# Altium schematic sheet CDR - dont change anything.SchDoc
size A2; SheetNumber: 1; SheetTotal: 4
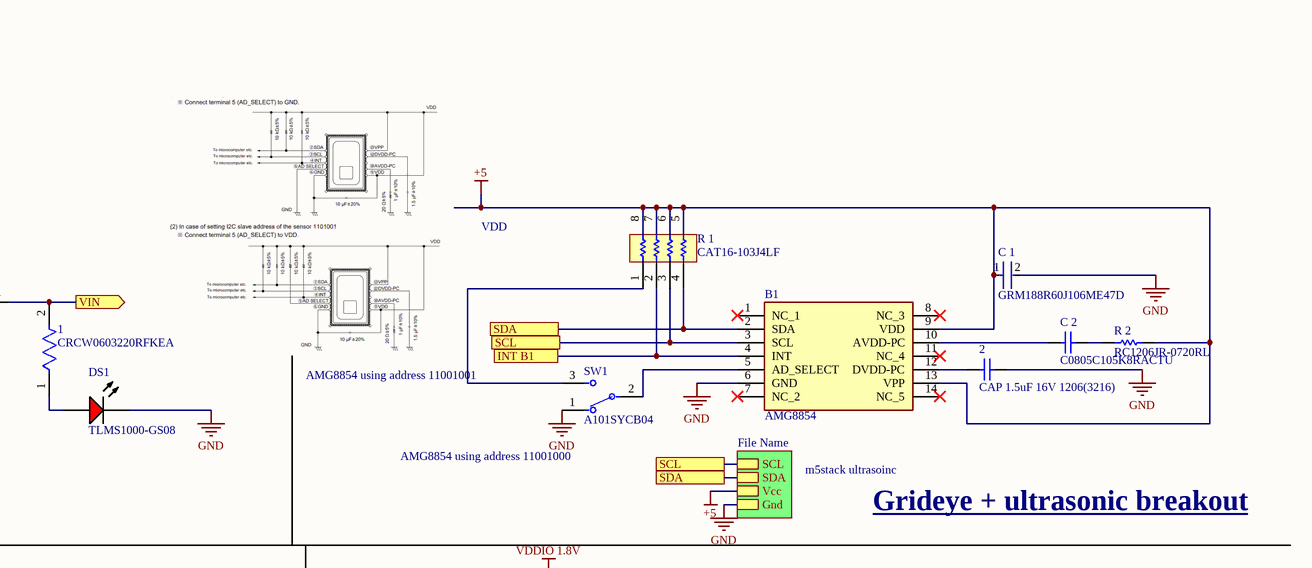
[diagram p0: CDR - dont change anything.SchDoc, top right]
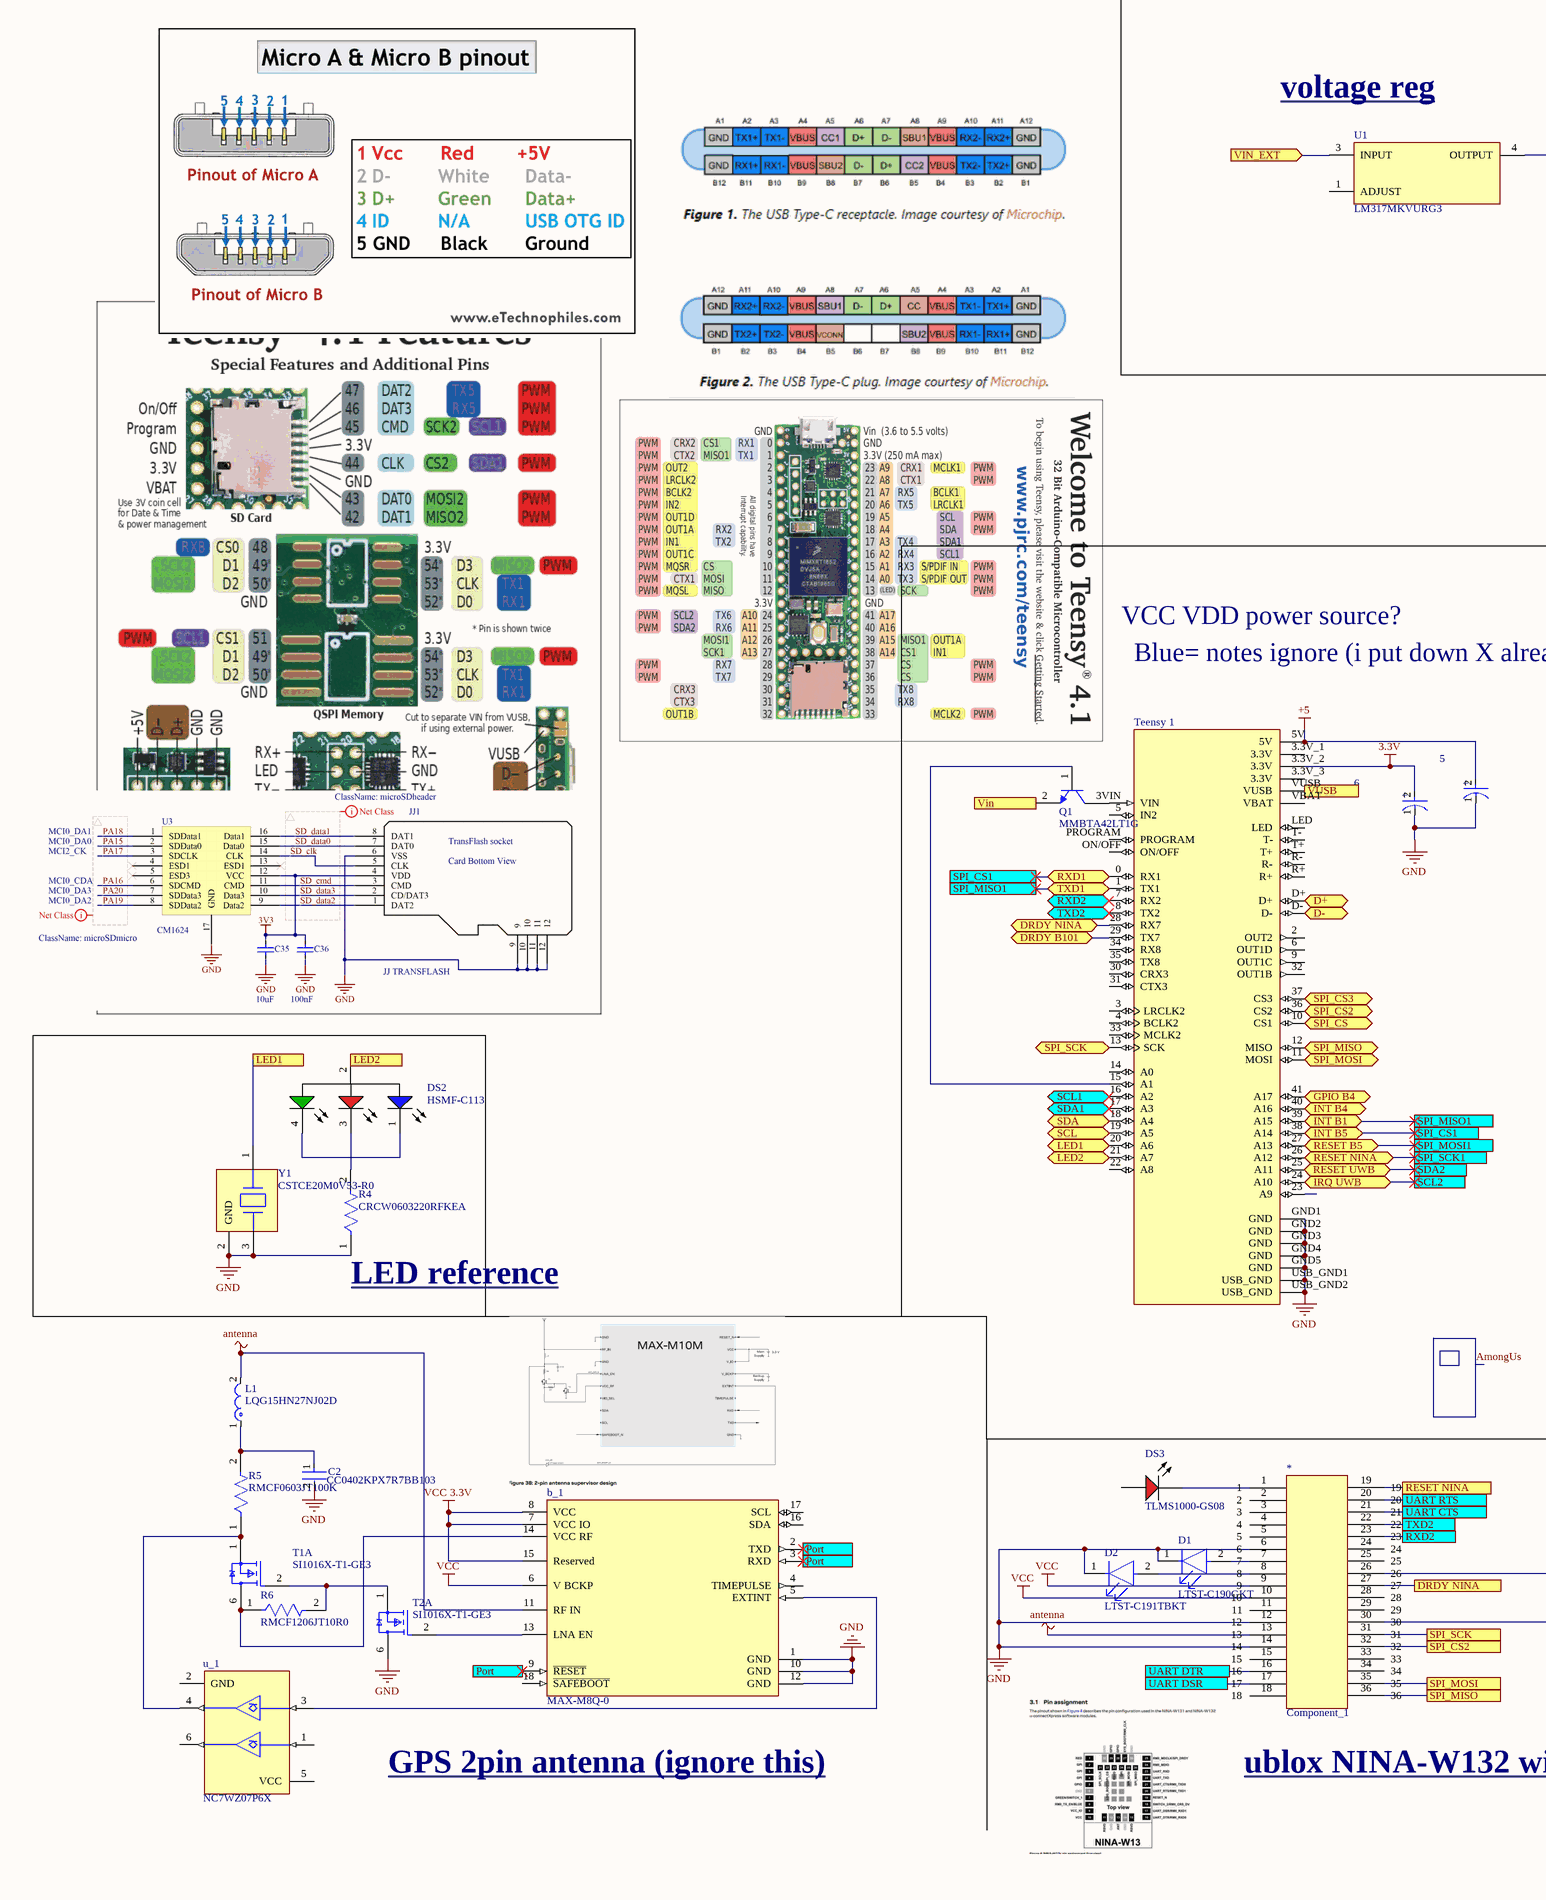
[diagram p1: CDR - dont change anything.SchDoc, bottom left]
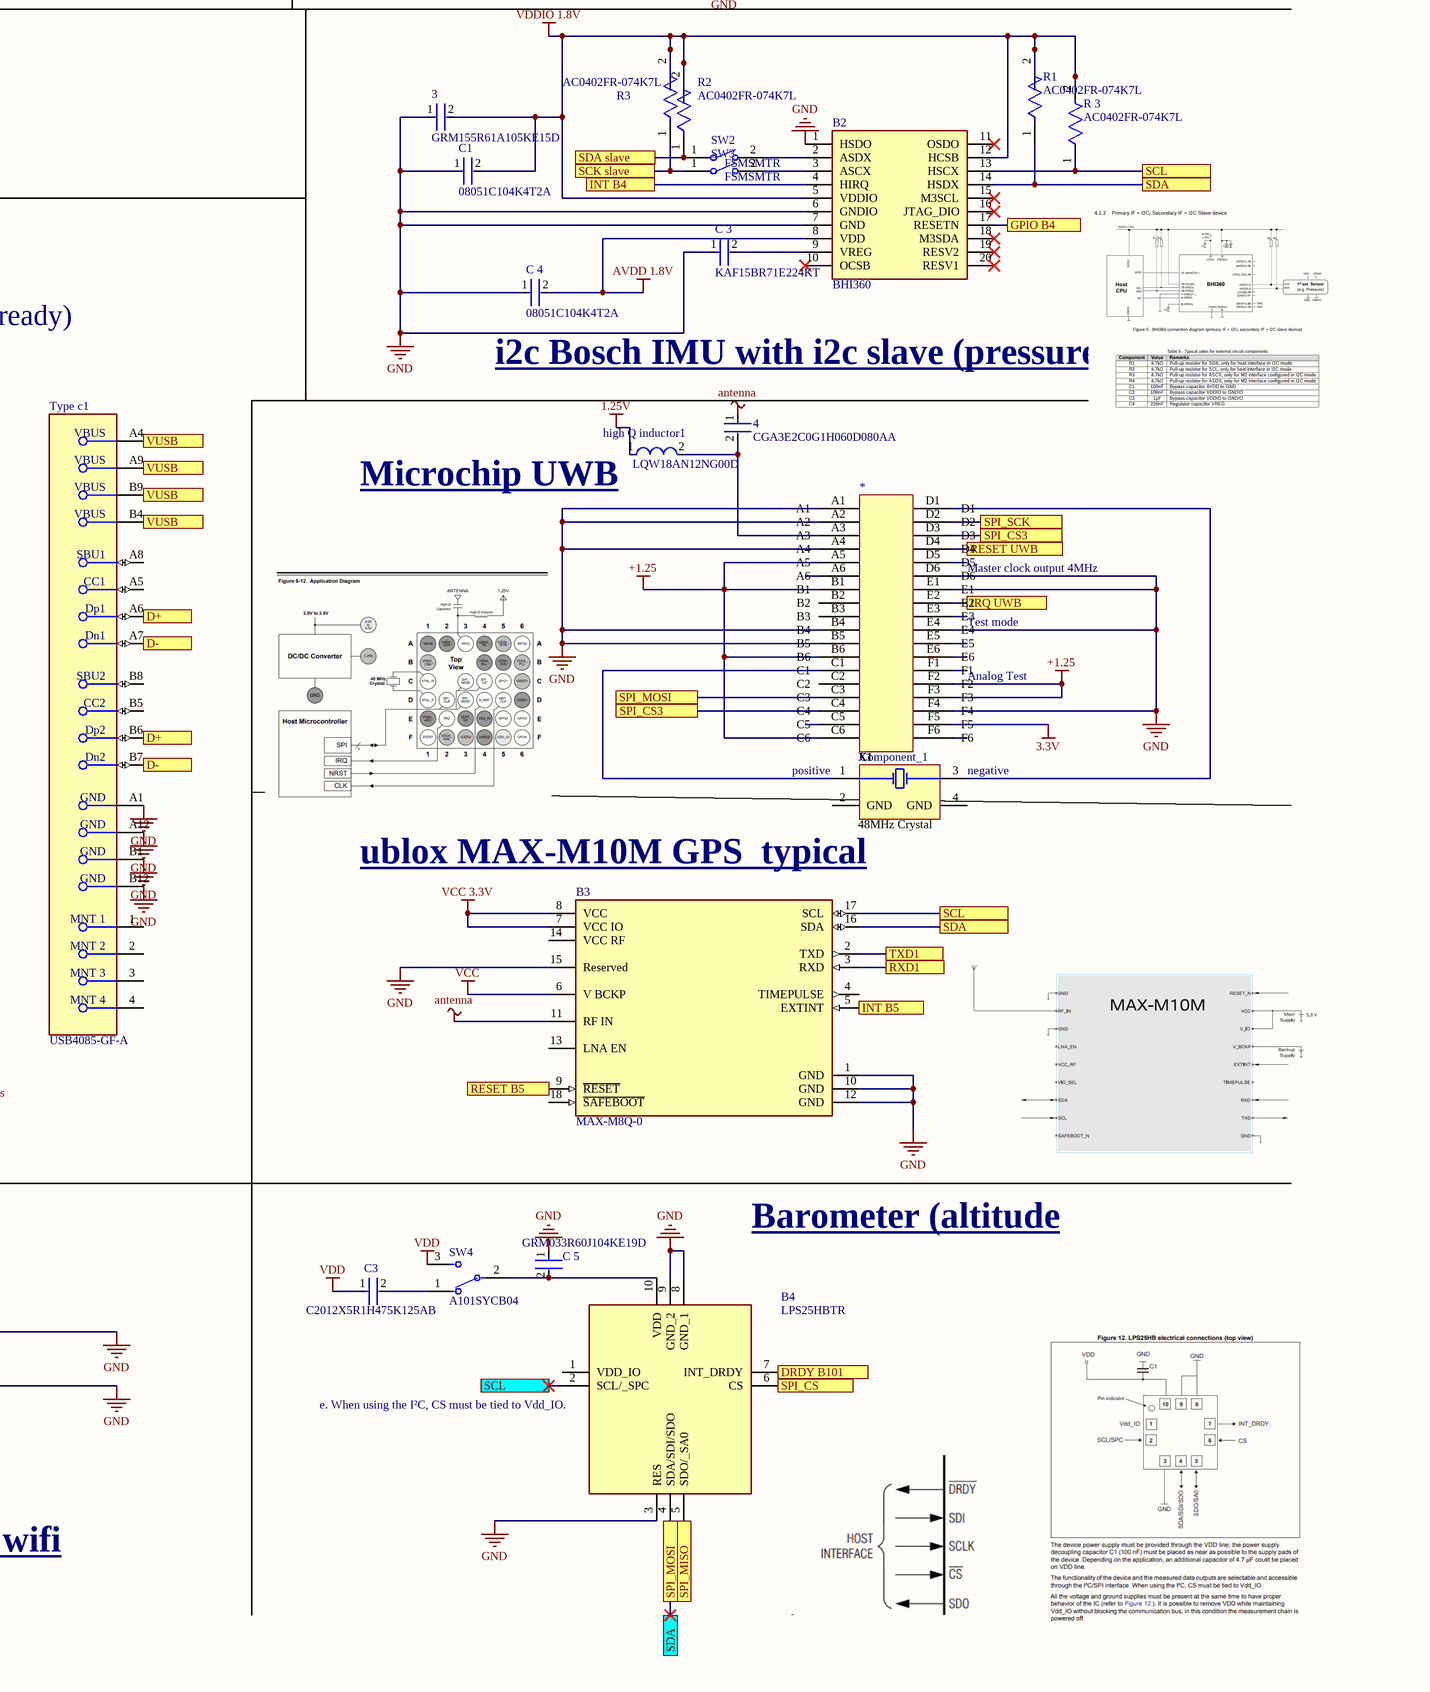
[diagram p2: CDR - dont change anything.SchDoc, bottom right]

## Parts
(Parts that share a designator on the sheet are numbered #1, #2 ... from top to bottom, then left to right.)
1  CRCW0603220RFKEA  [FP-CRCW0603-e3-MFG]
2  CAP 1.5uF 16V 1206(3216)  [CAPC1206(3216)190_M]
3  GRM155R61A105KE15D  [FP-GRM15-0_1-MFG]
4  CGA3E2C0G1H060D080AA  [FP-CGA3E-0_3-0_1-MFG]
5  293D105X0016A2TE3  [FP-293DA-MFG]  (value not drawn)
6  293D105X0016A2TE3  [FP-293DA-MFG]  (value not drawn)
*#1  Component_1  [ATA8350 - duplicate]
*#2  Component_1  [NINA-W131]
B1  AMG8854  [AMG8854]
B2  BHI360  [BHI360]
B3  MAX-M8Q-0  [FP-MAX-M8Q-0-MFG]
B4  LPS25HBTR  [LPS25HBTR]
b_1  MAX-M8Q-0  [FP-MAX-M8Q-0-MFG]
C1  08051C104K4T2A  [FP-0805-L_2_01_0_2-W_1_25-IPC_B]
C2  CC0402KPX7R7BB103  [FP-CC0402-MFG]
C3  C2012X5R1H475K125AB  [FP-C2012-125-0_2-IPC_B]
C_1  GRM188R60J106ME47D  [FP-GRM188-0_1-e0_2_0_55-IPC_A]
C_2  C0805C105K8RACTU  [CAPC2013X100X50ML20T25]
C_3  KAF15BR71E224KT  [FP-KAF15B-MFG]
C_4  08051C104K4T2A  [FP-0805-L_2_01_0_2-W_1_25-IPC_B]
C_5  GRM033R60J104KE19D  [FP-GRM033-0_03-MFG]
D1  LTST-C190GKT  [FP-LTST-C190GKT-MFG]
D2  LTST-C191TBKT  [FP-LTST-C191TBKT-MFG]
DS1  TLMS1000-GS08  [VISH-TLMS1000_V]
DS2  HSMF-C113  [AVAG-HSMF-C11X_H1_V]
DS3  TLMS1000-GS08  [VISH-TLMS1000_V]
high_Q_inductor1  LQW18AN12NG00D  [FP-LQW18AN_00-MFG]
L1  LQG15HN27NJ02D  [FP-LQG15HH_02-MFG]
Q1  MMBTA42LT1G  [ONSC-SOT-23-3-318-08_V]
R1  AC0402FR-074K7L  [FP-AC0402-MFG]
R2  AC0402FR-074K7L  [FP-AC0402-MFG]
R3  AC0402FR-074K7L  [FP-AC0402-MFG]
R4  CRCW0603220RFKEA  [FP-CRCW0603-e3-MFG]
R5  RMCF0603JT100K  [FP-RMCF0603-IPC_C]
R6  RMCF1206JT10R0  [FP-RMCF1206-IPC_C]
R_1  CAT16-103J4LF  [BOUR-CAT16-103J4LF_L]
R_2  RC1206JR-0720RL  [RESC3116X65X40NL10T20]
R_3  AC0402FR-074K7L  [FP-AC0402-MFG]
SW1  A101SYCB04  [FP-A101SYCB04-MFG]
SW2  FSMSMTR  [TECO-FSMSMTR_V]
SW3  FSMSMTR  [TECO-FSMSMTR_V]
SW4  A101SYCB04  [FP-A101SYCB04-MFG]
T1  SI1016X-T1-GE3  [FP-C14-0439-MFG]  (part A of 2)
T2  SI1016X-T1-GE3  [FP-C14-0439-MFG]  (part A of 2)
Teensy_1  Teensy 4.1  [MODULE_DEV-16771]  (value not drawn)
Type_c1  USB4085-GF-A  [FP-USB4085-GF-A-MFG]
U1  LM317MKVURG3  [FP-KVU0003A-MFG]
u_1  NC7WZ07P6X  [FP-419AD-01-MFG]
X1  48MHz Crystal  [ABRA-ABM3B-4_V]
Y1  CSTCE20M0V53-R0  [FP-CSTCE_V-MFG]

## Sub-sheets
m5stack ultrasoinc = File Name: SCL, SDA, Vcc, Gnd

## Ports
D+, D+ (bidir), D-, D- (bidir), DRDY B101, DRDY B101 (bidir), DRDY NINA, DRDY NINA (bidir), GPIO B4, GPIO B4 (bidir), INT B1, INT B1 (bidir), INT B4, INT B4 (bidir), INT B5, INT B5 (bidir), IRQ UWB, IRQ UWB (bidir), LED1, LED1 (bidir), LED2, LED2 (bidir), Port, RESET B5, RESET B5 (bidir), RESET NINA, RESET NINA (bidir), RESET UWB, RESET UWB (bidir), RXD1, RXD1 (bidir), RXD2, RXD2 (bidir), SCK slave, SCL, SCL1 (bidir), SCL2, SCL (bidir), SDA, SDA1 (bidir), SDA2, SDA (bidir), SDA slave, SPI_CS, SPI_CS1, SPI_CS2, SPI_CS2 (bidir), SPI_CS3, SPI_CS3 (bidir), SPI_CS (bidir), SPI_MISO, SPI_MISO1, SPI_MISO (bidir), SPI_MOSI, SPI_MOSI1, SPI_MOSI (bidir), SPI_SCK, SPI_SCK1, SPI_SCK (bidir), TXD1, TXD1 (bidir), TXD2, TXD2 (bidir), UART CTS, UART DSR, UART DTR, UART RTS, Vin (in), VIN (out), VIN_EXT (in), VUSB

## Nets
1.25V: high_Q_inductor1.1
3.3V: 6.2(A) Teensy_1.3.3V_2(3.3V)
+5: 5.2(A) B1.9(VDD) B1.13(VPP) C_1.1 R_1.5 R_1.6 R_1.7 R_1.8 R_2.2 Teensy_1.5V ; sheet m5stack ultrasoinc/Vcc
antenna: 4.1 B3.11(RF_IN) b_1.11(RF_IN) L1.2
AVDD 1.8V: B2.8(VDD) C_4.2
GND: 2.2 3.1 5.1(C) 6.1(C) B1.6(GND) B2.1(HSDO) B2.6(GNDIO) B2.7(GND) B3.1(GND) B3.10(GND) B3.12(GND) B3.15(Reserved) B4.3(RES) B4.8(GND_1) B4.9(GND_2) b_1.1(GND) b_1.10(GND) b_1.12(GND) C1.1 C2.2 C_1.2 C_3.1 C_4.1 C_5.1 D1.1(C) D2.1(C) DS1.2(K) R4.1 SW1.1 T2.6(D1) Teensy_1.GND1(GND) Teensy_1.GND2(GND) Teensy_1.GND3(GND) Teensy_1.GND4(GND) Teensy_1.GND5(GND) Teensy_1.USB_GND1(USB_GND) Teensy_1.USB_GND2(USB_GND) Type_c1.A1(GND) Type_c1.A12(GND) Type_c1.B1(GND) Type_c1.B12(GND) Y1.2(GND) Y1.3(Output) ; sheet m5stack ultrasoinc/Gnd
VCC: B3.6(V_BCKP) b_1.6(V_BCKP)
VCC 3.3V: B3.7(VCC_IO) B3.8(VCC) b_1.7(VCC_IO) b_1.8(VCC) b_1.15(Reserved)
VDD: C3.1 SW4.3
VDDIO 1.8V: 3.2 B2.5(VDDIO) B2.12(HCSB) C1.2 R1.2 R2.2 R3.2 R_3.2
D+: Teensy_1.D+ Type_c1.A6(Dp1) Type_c1.B6(Dp2) ; port D+
D-: Teensy_1.D- Type_c1.A7(Dn1) Type_c1.B7(Dn2) ; port D-
DRDY B101: B4.7(INT_DRDY) Teensy_1.29(TX7) ; port DRDY B101
DRDY NINA: Teensy_1.28(RX7) ; port DRDY NINA
GPIO B4: B2.17(RESETN) Teensy_1.41(A17) ; port GPIO B4
INT B1: B1.4(INT) B3.2(TXD) R_1.2 Teensy_1.1(TX1) Teensy_1.39(A15) ; port INT B1, port TXD1, port SPI_MISO1
INT B4: B2.4(HIRQ) Teensy_1.40(A16) ; port INT B4
INT B5: B3.3(RXD) B3.5(EXTINT) Teensy_1.0(RX1) Teensy_1.38(A14) ; port INT B5, port RXD1, port SPI_CS1
IRQ UWB: Teensy_1.24(A10) ; port SCL2, port IRQ UWB
LED1: Teensy_1.20(A6) Y1.1(Input) ; port LED1
LED2: DS2.2(A) Teensy_1.21(A7) ; port LED2
Port: b_1.2(TXD) b_1.3(RXD) b_1.9(~{RESET}) ; port Port
RESET B5: B3.9(~{RESET}) Teensy_1.27(A13) ; port RESET B5, port SPI_MOSI1
RESET NINA: Teensy_1.26(A12) ; port RESET NINA, port SPI_SCK1
RESET UWB: port SDA2, port RESET UWB
RXD2: Teensy_1.7(RX2) ; port RXD2
SCK slave: R3.1 SW3.1 ; port SCK slave
SCL: B1.3(SCL) B2.13(HSCX) B3.17(SCL) B4.2(SCL/_SPC) R_1.3 R_3.1 Teensy_1.19(A5) ; port SCL, sheet m5stack ultrasoinc/SCL
SCL1: Teensy_1.16(A2) ; port SCL1
SDA: B1.2(SDA) B2.14(HSDX) B3.16(SDA) B4.4(SDA/SDI/SDO) R1.1 R_1.4 Teensy_1.11(MOSI) Teensy_1.18(A4) ; port SDA, port SPI_MOSI, sheet m5stack ultrasoinc/SDA
SDA1: Teensy_1.17(A3) ; port SDA1
SDA slave: R2.1 SW2.1 ; port SDA slave
SPI_CS: B4.6(CS) Teensy_1.10(CS1) ; port SPI_CS
SPI_CS2: Teensy_1.36(CS2) ; port SPI_CS2
SPI_CS3: Teensy_1.37(CS3) ; port SPI_CS3
SPI_MISO: B4.5(SDO/_SA0) Teensy_1.12(MISO) ; port SPI_MISO
SPI_SCK: Teensy_1.13(SCK) ; port SPI_SCK
TXD2: Teensy_1.8(TX2) ; port TXD2
VIN: 1.2 Q1.2(E) U1.4(OUTPUT) ; port VIN, port Vin
VIN_EXT: U1.3(INPUT) ; port VIN_EXT
VUSB: Teensy_1.VUSB Type_c1.A4(VBUS) Type_c1.A9(VBUS) Type_c1.B4(VBUS) Type_c1.B9(VBUS) ; port VUSB
Net1_1: 1.1 DS1.1(A)
Net2_1: 2.1 B1.12(DVDD-PC)
Net4_2: 4.2 high_Q_inductor1.2
NetB1_5: B1.5(AD_SELECT) SW1.2
NetB1_10: B1.10(AVDD-PC) C_2.1
NetB2_2: B2.2(ASDX) SW2.2
NetB2_3: B2.3(ASCX) SW3.2
NetB2_9: B2.9(VREG) C_3.2
NetB4_10: B4.10(VDD) C_5.2 SW4.2
Netb_1_5: b_1.5(EXTINT) u_1.3(A2)
Netb_1_13: b_1.13(LNA_EN) T2.2(G1)
Netb_1_14: b_1.14(VCC_RF) R6.1 T1.6(D1)
NetC2_1: C2.1 L1.1 R5.2
NetC3_2: C3.2 SW4.1
NetC_2_2: C_2.2 R_2.1
NetDS2_1: DS2.1(K) DS2.4(K)
NetDS2_3: DS2.3(K) R4.2
NetQ1_1: Q1.1(B) Teensy_1.15(A1)
NetQ1_3: Q1.3(C) Teensy_1.VIN
NetR5_1: R5.1 T1.1(S1) u_1.4(Y2)
NetR6_2: R6.2 T1.2(G1) T2.1(S1)
NetR_1_1: R_1.1 SW1.3

Not connected (* = marked no-connect by the designer): *#1 A1 A2 A3 A4 A5 A6 B1 B2 B3 B4 B5 B6 C1 C2 C3 C4 C5 C6 D1 D2 D3 D4 D5 D6 E1 E2 E3 E4 E5 E6 F1 F2 F3 F4 F5 F6; *#2 1 2 3 4 5 6 7 8 9 10 11 12 13 14 15 16 17 18 19 20 21 22 23 24 25 26 27 28 29 30 31 32 33 34 35 36; B1 1(NC_1)* 7(NC_2)* 8(NC_3)* 11(NC_4)* 14(NC_5)*; B2 10(OCSB)* 11(OSDO)* 15(M3SCL)* 16(JTAG_DIO)* 18(M3SDA)* 19(RESV2)* 20(RESV1)*; B3 4(TIMEPULSE) 13(LNA_EN) 14(VCC_RF) 18(~{SAFEBOOT}); B4 1(VDD_IO); b_1 4(TIMEPULSE) 16(SDA) 17(SCL) 18(~{SAFEBOOT}); D1 2(A); D2 2(A); DS3 1(A) 2(K); Teensy_1 2(OUT2) 3(LRCLK2) 3.3V_1(3.3V) 3.3V_3(3.3V) 4(BCLK2) 5(IN2) 6(OUT1D) 9(OUT1C) 14(A0) 22(A8) 23(A9) 25(A11) 30(CRX3) 31(CTX3) 32(OUT1B) 33(MCLK2) 34(RX8) 35(TX8) LED ON/OFF PROGRAM R+ R- T+ T- VBAT; Type_c1 1(MNT_1) 2(MNT_2) 3(MNT_3) 4(MNT_4) A5(CC1) A8(SBU1) B5(CC2) B8(SBU2); U1 1(ADJUST); u_1 1(A1) 2(GND) 5(VCC) 6(Y1); X1 1(X1) 2(GND) 3(X2) 4(GND)

## Notes on the sheet
- voltage reg
- VDD
- AMG8854 using address 11001001
- (near SW1) AMG8854 using address 11001000
- Grideye + ultrasonic breakout
- VCC VDD power source?
- Blue= notes ignore (i put down X already)
- i2c Bosch IMU with i2c slave (pressure meter)
- (near high_Q_inductor1) Microchip UWB
- (near *#1) Master clock output 4MHz
- (near *#1) Test mode
- (near *#1) Analog Test
- positive
- negative
- ublox MAX-M10M GPS  typical
- (near R4) LED reference
- Barometer (altitude
- (near B4) e. When using the I²C, CS must be tied to Vdd_IO.
- GPS 2pin antenna (ignore this)
- ublox NINA-W132 wifi
- (in symbol CMP-00030-40940187-1) +

## Library data of the parts
1 R4 = CMP-2000-03085-2: RES Thick Film, 220Ω, 1%, 0.1W, 100ppm/°C, 0603; Power Rating: 100mW; Voltage Rating: 75V; Resistance: 220R; Contact Plating: Tin; Package Quantity: 10; Lead Free: Lead Free; Packaging: Tape and Reel; Max Operating Temperature: 155°C; Case/Package: 0603; Radiation Hardening: No; Height: 0.45mm; Width: 0.033inch; Case Code (Imperial): 0603; Number of Terminations: 2; Tolerance: 1%; Min Operating Temperature: -55°C; Termination: SMD/SMT; Length: 1.55mm; Features: Automotive AEC-Q200; Voltage Rating (DC): 75V; Case Code (Metric): 1608; Composition: Thick Film; Military Standard: Not; Temperature Coefficient: 100ppm/°C; Depth: 0.85mm; Weight: 7.1E-05oz; Max Power Dissipation: 100mW
2 = CMP-1037-04758-1: CAP 1.5uF 16V ±10% 1206 (3216 Metric) Thickness 1.9mm SMD; Case-EIA: 1206; Case-Metric: 3216; Tolerance: Â±10%; Rated Voltage: 16 V; Value: 1.5uF; Technology: SMT; Max Thickness: 1.9 mm
3 = CMP-2008-04556-2: CAP CER 1UF 10V X5R 0402; Manufacturer: Murata; Tolerance: 10%; Temperature Coefficient: 15%; Octopart: https://octopart.com/grm155r61a105ke15d-murata-197442; Manufacturer Part Number: GRM155R61A105KE15D; Lead Free: Yes; ComponentLink2Description: Datasheet; Temperature: -55°C to +85°C; Temperature Range High: +85°C; Height: 0.55mm; Capacitance: 1uF; Ipc Land Pattern Name: CAPC10050X50; ComponentLink2URL: https://search.murata.co.jp/Ceramy/image/img/A01X/G101/ENG/GRM155R61A105KE15-01A.pdf; Temperature Range Low: -55°C; Device Class L2: Capacitors; Voltage Rating: 10V; RoHS: TRUE; Device Class L1: Passive Components; Device Class L3: Ceramic Capacitors; Temperature Characteristic: X5R; Material: Ceramic; Mouser Description: 0402 1 uF 10 V ±10% Tolerance X5R Surface Mount Multilayer Ceramic Capacitor; Automotive: No; Package: GRM15-0.1; Digikey Description: CAP CER 1UF 10V X5R 0402; Value: 1uF; Category: Cap
4 = CMP-08246-001317-1: Cap Ceramic 6pF 50V C0G 0.5pF Pad SMD 0603 +125°C Automotive T/R; Weight: 7.1E-05oz; Capacitance: 6pF; Min Operating Temperature: -55°C; Termination: SMD/SMT; Mount: Surface Mount; Thickness: 0.035inch; Voltage Rating: 50V; Case Code (Metric): 1608; Package Quantity: 1; Length: 1.6mm; Dielectric: C0G; REACH SVHC: No SVHC; Packaging: Tape and Reel; Height: 0.8mm; Composition: Ceramic; Depth: 0.8mm; Case Code (Imperial): 0603; Case/Package: 0603; Max Operating Temperature: 125°C; Voltage Rating (DC): 50V; Ratings: AEC-Q200; Width: 0.031inch
5 6 = CMP-00030-40940187-1: 293D105X0016A2TE3 Surface Mount Tantalum Capacitor, 1 uF, 16 V, ± 20%, -55 °C, 125 °C, 1206 [3216-18 Metric]; Ripple Current: 90mA; Capacitance: 1µF; Leakage Current: 500nA; Polarity: Polar; Voltage Rating (DC): 16V; Dissipation Factor: 4%; ESR (Equivalent Series Resistance): 9.3Ω; Case Code (Imperial): 1206; Case/Package: 1206; Schedule B: 8532210050, 8532210050; Height: 1.8mm; Mount: PCB, Surface Mount; Height - Seated (Max): 1.8034mm; Min Operating Temperature: -55°C; Max Operating Temperature: 125°C; Dielectric Material: Tantalum; Packaging: Tape and Reel; Radiation Hardening: No; Lead Free: Lead Free; Features: General Purpose; REACH SVHC: Unknown; Width: 1.6002mm; RoHS: Compliant; Tolerance: 20%; Termination: SMD/SMT; Length: 3.2mm; Depth: 1.6mm; Number of Pins: 2; Voltage Rating: 16V; NexarPartId: 40940187; Case Code (Metric): 3216
B1 = AMG8854: Product: Infrared Array Sensor Grid-EYE, Series/Type: AMG88xx (High performance type), Number of pixel: 64 (Vertical 8 x Horizontal 8 Matrix), Operating voltage (DC) (V): 5, Viewing angle (): 60, Amplification factor: Low gain, Mounting form: Surface Mount Type; Manufacturer_Name: Panasonic; Geometry.Height: 4.3mm; Mouser Part Number: 667-AMG8854; Mouser Price/Stock: https://www.mouser.co.uk/ProductDetail/Panasonic/AMG8854?qs=sSYV1F9c5cGiWvzHDbpBOw%3D%3D; Manufacturer_Part_Number: AMG8854; Datasheet Link: https://industrial.panasonic.com/cdbs/www-data/pdf/ADI8000/ADI8000C66.pdf
B2 = BHI360: IMUs - Inertial Measurement Units Programmable smart sensor combining accelerometer, gyroscope and fusion software; Manufacturer_Name: BOSCH; Geometry.Height: 1mm; Mouser Part Number: 262-BHI360; Mouser Price/Stock: https://www.mouser.co.uk/ProductDetail/Bosch-Sensortec/BHI360?qs=ulEaXIWI0c93cz3Dqv%252BGgg%3D%3D; Manufacturer_Part_Number: BHI360; Datasheet Link: https://www.bosch-sensortec.com/media/boschsensortec/downloads/datasheets/bst-bhi360-ds000.pdf
B3 b_1 = CMP-207130-000017-1: RF RCVR GNSS/GPS 1.575GHZ 18LCC; Sensitivity: -167dBm; Current - Receiving: 23mA; Interface: I2C; Frequency: 1.575GHz; Min Operating Temperature: -40°C; Case/Package: SMD/SMT; RoHS Compliant: Yes; Packaging: Cut Tape; Max Operating Temperature: 85°C
B4 = LPS25HBTR: Board Mount Pressure Sensor 26kPa to 126kPa Absolute 10-Pin HLGA T/R; Manufacturer_Name: STMicroelectronics; Geometry.Height: 0.8mm; Mouser Part Number: 511-LPS25HBTR; Mouser Price/Stock: https://www.mouser.co.uk/ProductDetail/STMicroelectronics/LPS25HBTR?qs=GDOUxV2YAh9IvjPyBKWGzQ%3D%3D; Manufacturer_Part_Number: LPS25HBTR; Datasheet Link: https://www.st.com/resource/en/datasheet/lps25hb.pdf
C1 C_4 = CMP-2007-04172-2: Automotive Ceramic Capacitor, 0805, 100nF, 10%, X7R, 15%, 100V; Voltage Rating (DC): 100V; Case Code (Metric): 2012; Mount: Surface Mount; Length: 2.01mm; Depth: 1.25mm; Lead Free: Lead Free; Ratings: AEC-Q200; Max Operating Temperature: 125°C; Tolerance: 10%; Case/Package: 0805; Width: 0.049inch; Package Quantity: 1; Thickness: 0.055inch; Construction: Flat; Min Operating Temperature: -55°C; REACH SVHC: No SVHC; Number of Pins: 2; Radiation Hardening: No; Capacitance: 100nF; Voltage Rating: 100V; Height: 1.4mm; Series: -; Voltage: 100V; Dielectric: X7R; Termination: SMD/SMT; Case Code (Imperial): 0805; RoHS Compliant: Yes; Packaging: Tape and Reel; Dielectric Material: Ceramic
C2 = CMP-03422-000420-1: CC0402 10 nF X7R 10.00% 16 V; Manufacturer: YAGEO; Capacitance: 10 nF; Value: 10 nF; Tolerance: 0.1; Voltage Rating: 16 V; Automotive Grade: NA; Temperature Coefficient: 30ppm/°C; Material: Ceramic; Automotive: No; Device Class L1: Passive Components; Temperature Range Low: -55°C; Ipc Land Pattern Name: CAPC10050X50; Temperature Characteristic: X7R; Lead Free: Yes; Footprint Url: http://www.yageo.com/exep/pages/download/literatures/UPY-C_GEN_24.pdf; Octopart: https://octopart.com/cc0402kpx7r7bb103-yageo-12885102; RoHS: TRUE; Height: 0.55mm; Device Class L3: Ceramic Capacitors; Mouser Description: Multilayer Ceramic Capacitors MLCC - SMD/SMT 10nF 16V X7R 10%; Package: CC0402; ComponentLink2Description: Datasheet; Category: Cap; ComponentLink2URL: http://www.yageo.com/documents/recent/UPY-GP_NP0_16V-to-50V_16.pdf; Temperature: -55°C to +125°C; Manufacturer Part Number: CC0402KPX7R7BB103; Temperature Range High: +125°C; Device Class L2: Capacitors
C3 = CMP-08246-000007-2: Multilayer Ceramic Capacitors 4.7μF ±10% 50V X5R SMD 0805; Capacitance: 4.7uF; Case Code (Metric): 2012; Weight: 0.000194oz; Voltage Rating: 50V; Voltage: 50V; Construction: Flat; Series: C; Packaging: Tape and Reel; Height: 1.25mm; Depth: 1.25mm; Resistor Type: Ceramic; Width: 0.049inch; Length: 2mm; Thickness: 0.057inch; REACH SVHC: No SVHC; Max Operating Temperature: 85°C; Case/Package: 0805; Dielectric: X5R; Tolerance: 10%; Dielectric Material: Ceramic; Package Quantity: 1; Mount: Surface Mount; Radiation Hardening: No; Voltage Rating (DC): 50V; Case Code (Imperial): 0805; Termination: SMD/SMT; Min Operating Temperature: -55°C; Lead Free: Lead Free
C_1 = CMP-2006-02792-2: Chip Multilayer Ceramic Capacitors for General Purpose, 0603, 10uF, X5R, 15%, 20%, 6.3V; Packaging: Tape and Reel; Voltage Rating (DC): 6.3V; Width: 0.031inch; Termination: SMD/SMT; Dielectric: X5R; Package Quantity: 4000; Voltage Rating: 6.3V; Capacitance: 10uF; Case/Package: 0603; Min Operating Temperature: -55°C; Voltage: 6.3V; Length: 1.6mm; Thickness: 0.035inch; Lead Free: Lead Free; Depth: 0.8mm; Case Code (Imperial): 0603; Max Operating Temperature: 85°C; Material: Ceramic; Height: 0.8mm; Tolerance: 20%; Mount: Surface Mount; REACH SVHC: No SVHC; Radiation Hardening: No; Case Code (Metric): 1608
C_2 = CMP-2007-03676-1: Manufacturer: Kemet; Part Number: C0805C105K8RACTU
C_3 = CMP-00048-140164113-1: KAF15BR71E224KT .22UF 25V 10% 0603; Capacitance: 220nF; NexarPartId: 140164113; Tolerance: 10%; Material: Ceramic; Height: 950µm; Voltage Rating: 25V; Min Operating Temperature: -55°C; Max Operating Temperature: 125°C; Case/Package: 0603
C_5 = CMP-06035-000062-2: Chip Multilayer Ceramic Capacitors for General Purpose, 0201, 0.10uF, X5R, 15%, 10%, 6.3V; Capacitance: 100nF; Min Operating Temperature: -55°C; Lead Free: Lead Free; Radiation Hardening: No; Dielectric: X5R; Voltage Rating (DC): 6.3V; REACH SVHC: No SVHC; Case/Package: 0201; Voltage Rating: 6.3V; Length: 0.6mm; Max Operating Temperature: 85°C; Width: 0.012inch; Depth: 0.3mm; Material: Ceramic; Case Code (Metric): 0603; Thickness: 0.013inch; Packaging: Tape and Reel; Height: 0.3mm; Weight: 6E-06oz; Package Quantity: 1; Mount: Surface Mount; Voltage: 6.3V; Case Code (Imperial): 0201; Tolerance: 10%; Termination: SMD/SMT
D1 = CMP-22017-000005-2: LED GREEN CLEAR CHIP SMD; Dominant Wavelength: 569nm; Reverse Voltage: 5V; Lens Color: Colorless; Viewing Angle: 130°; Voltage: 2V; Forward Current: 30mA; Power Dissipation: 100mW; Luminous Intensity: 6mcd; Number of LEDs: 1; Forward Voltage: 2.1V; Wavelength: 565nm; Test Current: 10mA; Min Operating Temperature: -55°C; Lens Style: Clear; Mount: Surface Mount; Width: 0.8mm; Packaging: Tape and Reel; Lens Transparency: Clear; Case Code (Metric): 1608; Depth: 0.8mm; Case Code (Imperial): 0603; Case/Package: 0603; Number of Pins: 2; Max Operating Temperature: 85°C; Lead Free: Lead Free; Number of Elements: 1; Length: 1.6mm; Height: 0.8mm; Package Quantity: 1; Power Rating: 100mW; Radiation Hardening: No; Illumination Color: Green; Color: Green
D2 = CMP-22017-000008-1: LED BLUE CLEAR CHIP SMD; Lens Color: Colorless; Dominant Wavelength: 475nm; Forward Current: 20mA; Wavelength: 468nm; Viewing Angle: 130°; Power Dissipation: 76mW; Luminous Intensity: 180mcd; Reverse Voltage: 5V; Number of Elements: 1; Lens Style: Diffused; Forward Voltage: 3.8V; Max Power Dissipation: 75mW; Case Code (Metric): 1608; Packaging: Tape and Reel; Case/Package: 0603; Depth: 1.6mm; Mount: Surface Mount; Lead Free: Lead Free; Min Operating Temperature: -20°C; Lens Transparency: Clear; Illumination Color: Blue; Height: 0.55mm; Test Current: 20mA; Case Code (Imperial): 0603; Max Operating Temperature: 80°C; Number of Pins: 2; Length: 0.8mm; Radiation Hardening: No; Package Quantity: 1; Number of LEDs: 1; Width: 0.8mm; Color: Blue
DS1 DS3 = CMP-2000-07254-1: Low Current LED, 40 mW, 1.8 V, -40 to 100 degC, 2-Pin SMD (0603), RoHS, Tape and Reel; Manufacturer: Vishay; Lens Shape: Rectangular; Automotive Qualification Standard: AEC-Q100; Wavelength Typ: 636nm; SVHC: ToBeAdvised; LED Colour: Red; Bulb Size: 1.6mmx0.8mm; Forward Voltage: 1.8V; Luminous Intensity: 4mcd; Forward Current If: 2mA; Viewing Angle: 80°; Datasheet Version: Rev. 1.7, 02/2011; Datasheet URL: https://datasheet.ciiva.com/5798/1698881-5798337.pdf; LED Mounting: SMD; Packaging: CutTape; Package Reference: TLMS1000; Manufacturer URL: http://www.vishay.com/; Mounting Technology: SurfaceMount; Product Range: -; Package Description: 2-Pin Surface Mount Device, Body 1.6 x 0.8 mm; MSL: MSL2-1year
DS2 = CMP-2000-06422-1: Right Angle Tricolor Surface Mount Chip LED, Red/Green/Blue, -40 to 85 degC, 4-Pin SMD, RoHS, Tape and Reel; Manufacturer: Avago; Product Length (mm): 2.5mm; Product Depth (mm): 1mm; Shape Type: Rectangular; Dominant Wave Length: 470/572/626nm; Number of  Elements: 3; Type: Tri-Color; Lens Type: ColorlessDiffused; Peak Wavelength: 468/570/637nm; Luminous Intensity: 60/50/80mcd; Test Current (It): 20mA; Power Dissipation: 59/39/36W; Viewing Angle: 125/125/120deg; Rad Hardened: No; Reverse Voltage: 5V; DELETED: Compliant; Forward Voltage: 3.9/2.6/2V; High Brightness: Yes; Manufacturer URL: http://www.avagotech.com/; Datasheet URL: https://datasheet.ciiva.com/15117/getdatasheetpartid-133115-15117679.pdf; Main Category: ChipLED; Package Reference: HSMF-C11X; Mounting Technology: SurfaceMount; Datasheet Version: 04/2010; Lum Intensity: 60/50/80mcd; Lens Dimensions: 2.1x1x0.5mm; Forward Current: 20mA; Pin Count: 4; Package Description: 4-Pin Surface Mount Device, Body 2.5 x 1 mm; Packaging: TapeandReel; Package Type: ChipLed; Mounting: SurfaceMount; Operating Temp Range: -40Cto85C; Operating Temperature Classification: Industrial; Product Height (mm): 1mm
high_Q_inductor1 = CMP-06042-001615-1: Wire Wound RF Inductor 12nH ±2% 600mA 0.13Ω 0603 (1608); Test Frequency: 100MHz; Series Resistance: 130mR; Self Resonant Frequency: 6GHz; Current: 500mA; Shielding: Unshielded; Q Factor: 35; Inductance: 12nH; Case Code (Metric): 1608; Case/Package: 0603; Max Operating Temperature: 125°C; Height: 0.8mm; Case Code (Imperial): 0603; Min Operating Temperature: -55°C; Radiation Hardening: No; Width: 0.8mm; Package Quantity: 4000; Number of Pins: 2; Tolerance: 2%; Lead Free: Lead Free; Termination: SMD/SMT; DC Resistance (DCR): 130mR; Packaging: Tape and Reel; Inductance Tolerance: 2%; Current Rating: 600mA; Weight: 0.000106oz; Length: 1.6mm; REACH SVHC: No SVHC; DC Current: 600mA; Depth: 1mm; Military Standard: Not; Max DC Current: 600mA; Resistor Type: Wirewound; Mount: Surface Mount
L1 = CMP-06042-015205-1: Multilayer type RF Inductor 27nH ±5% 0.67Ω 300mA 0402; Shielding: Unshielded; DC Resistance (DCR): 670mR; Test Frequency: 100MHz; Q Factor: 8; Core Material: Air; Self Resonant Frequency: 1.6GHz; Max DC Current: 300mA; Width: 0.02inch; Min Operating Temperature: -55°C; Package Quantity: 10000; Inductance: 27nH; Lead Free: Lead Free; Case/Package: 0402; Height: 0.02inch; Depth: 0.55mm; Length: 0.039inch; REACH SVHC: No SVHC; Radiation Hardening: No; Height - Seated (Max): 0.022inch; Max Operating Temperature: 125°C; Inductance Tolerance: 5%; Current Rating: 300mA; Termination: SMD/SMT; Case Code (Imperial): 0402; DC Current: 300mA; Packaging: Tape and Reel; Tolerance: 5%; Case Code (Metric): 1005; Military Standard: Not; Mount: Surface Mount
Q1 = CMP-1048-00662-1: High Voltage Transistor, NPN Silicon, 3-Pin SOT-23, Pb-Free, Tape and Reel; Manufacturer: On Semiconductor; fT Min (MHz): 50; IC Continuous (A): 0.5; ComponentLink1URL: http://www.onsemi.com/; ComponentLink3URL: http://www.onsemi.cn/pub_link/Collateral/318-08.PDF; RoHS: TRUE; ComponentLink2Description: Datasheet; PartNumber: MMBTA42LT1G; Polarity: NPN; DatasheetVersion: Rev. 12; PackageReference: SOT-23-3-318-08; PackageDescription: 3-Pin Small Outline Transistor, Body 2.92 x 1.3 mm, Pitch 0.95 mm; ComponentLink3Description: Package Specification; ComponentLink1Description: Manufacturer URL; Packing: Tape and Reel; PackageVersion: Rev. AP, 11/2009; Mounting Technology: Surface Mount; ComponentLink2URL: http://www.onsemi.cn/pub_link/Collateral/MMBTA42LT1-D.PDF
R1-R3 R_3 = CMP-2002-01824-3: RES 4.7kΩ ±1% 0.063W 0402; Power Rating: 62.5mW; Resistance: 4.7kR; Max Power Dissipation: 63mW; Voltage Rating: 50V; Temperature Coefficient: 100ppm/°C; Max Operating Temperature: 155°C; Tolerance: 1%; Series: AC; Size Code: 0402; Case Code (Metric): 1005; Termination: SMD/SMT; Packaging: Tape and Reel; Min Operating Temperature: -55°C; RoHS Compliant: Yes; Features: Moisture Resistant; Length: 0.039inch; Width: 0.5mm; Weight: 2.3E-05oz; Lead Free: Lead Free; Resistor Type: Thick Film; Case Code (Imperial): 0402; Height: 0.015inch; Case/Package: 0402; Number of Terminations: 2
R5 = CMP-26527-000115-1: 100kΩ ±5% 0.1W 0603 Thick Film Chip Resistor AEC-Q200 compliant; Resistance: 100kR; Max Power Dissipation: 100mW; Temperature Coefficient: 100ppm/°C; Resistor Type: Thick Film; Height: 0.022inch; Features: Automotive AEC-Q200; Contact Plating: Tin; Lead Free: Lead Free; Number of Terminations: 2; Radiation Hardening: No; Military Standard: Not; Power Rating: 100mW; Mount: Surface Mount; Case Code (Imperial): 0603; Case Code (Metric): 1608; Depth: 0.8mm; Construction: Rectangular; Width: 0.031inch; RoHS Compliant: Yes; Length: 1.55mm; Max Operating Temperature: 155°C; Min Operating Temperature: -55°C; Case/Package: 0603; Tolerance: 5%; Series: RMCF; Packaging: Tape and Reel
R6 = CMP-26527-003359-1: 10Ω ±5% 0.25W 1206 Thick Film Chip Resistor AEC-Q200 compliant; Temperature Coefficient: 200ppm/°C; Max Power Dissipation: 250mW; Resistance: 10R; Length: 3.2mm; Width: 0.063inch; Series: RMCF; Max Operating Temperature: 155°C; Resistor Type: Thick Film; Military Standard: Not; Mount: Surface Mount; Size Code: 1206; Contact Plating: Tin; Lead Free: Lead Free; Radiation Hardening: No; Min Operating Temperature: -55°C; Tolerance: 5%; Case Code (Imperial): 1206; Features: Automotive AEC-Q200; Construction: Rectangular; Case/Package: 1206; Height: 0.028inch; RoHS Compliant: Yes; Power Rating: 250mW; Packaging: Tape and Reel; Case Code (Metric): 3216; Number of Terminations: 2; Depth: 1.6mm
R_1 = CMP-2000-06067-1: CAT / CAY 16 Series - Chip Resistor Array, 10 KOhm, +/- 5%, 50 V, -55 to 125 degC, 8-Pin SMD, RoHS, Tape and Reel; Manufacturer: Bourns; Power Per Element: 62.5mW; Online Catalog: CAT16Series; Resistance (Ohms): 10k; Number of Resistors: 4; EDA / CAD Models: DownloadfromAcceleratedDesigns; Temperature Coefficient: ±200ppm/°C; Circuit Type: Isolated; Other Names: CAT16-103J4LFDKR; Package Reference: CAT16-103J4LF; Datasheet Version: 09/2014; Series: CAT16; Manufacturer URL: http://www.bourns.com/; Mounting Type: SurfaceMount; Datasheet URL: http://www.mouser.com/ds/2/54/ATCAY-777361.pdf; Category: Resistors; Height: 0.024"(0.60mm); Mounting Technology: SurfaceMount; Applications: -; Size / Dimension: 0.126"Lx0.061"W(3.20mmx1.55mm); Packaging: Digi-Reel®; Package / Case: 1206(3216Metric),Concave,LongSideTerminals; Supplier Device Package: 1206; RoHS Information: CAT16MaterialDeclaration; Number of Pins: 8; Family: ResistorNetworks,Arrays; Standard Package: 1; Package Description: 8-Pin Surface Mount Device, Body 3.2 x 1.55 mm, Pitch 0.8 mm; Operating Temperature: -55°C~125°C; Tolerance: ±5%
R_2 = CMP-2003-03957-1: Manufacturer: Yageo; Part Number: RC1206JR-0720RL
SW1 SW4 = CMP-03408-000017-1: SWITCH TOGGLE SPDT 0.4VA 20V; Electrical Life: 6000Cycles; Number of Poles: 1; Power Rating: 400mW; Switch Function: On-On; Contact Resistance: 10mR; Contact Current Rating: 400mA; Actuator Material: Phenolic; Insulation Resistance: 30MR; Actuator Color: Chrome; Number of Positions: 2; Actuator Type: Standard Round; Actuator Length: 10.41mm; Illumination Type: Non-Illuminated; Flammability Rating: UL94 V-1; Contact Material: Copper; Depth: 6.86mm; Contact Plating: Gold; Voltage Rating (AC): 20V; Max Voltage Rating (DC): 20V; Min Operating Temperature: -30°C; Max Operating Temperature: 85°C; Throw Configuration: SPDT; Packaging: Bulk; Termination: PC Pins; Series: Gemini A; ELV: Compliant; Lead Free: Lead Free; RoHS Compliant: Yes; REACH SVHC: No SVHC; Mount: Panel; Orientation: Straight; Package Quantity: 100; Max Voltage Rating (AC): 20V; Radiation Hardening: No; Voltage Rating (DC): 20V
SW2 SW3 = CMP-2000-07501-1: FSMSM Push Button Switch, 50 mA, -35 to 85 degC, 2-Pin SMD, RoHS, Tape and Reel; Manufacturer: TE Connectivity; Voltage Rating (DC): 24V; Electrical Life: 20000Cycles; Operating Force: 180gf; Switch Travel: 0.25mm; Contact Current Rating: 50mA; Case\/Package: SMD/SMT; Actuator Length: 1.07mm; Throw Configuration: SPST; Actuator Material: Polyamide; Contact Resistance: 100mOhm; Illumination Type: Illuminated; Max Voltage Rating (DC): 12V; Manufacturer URL: http://www.te.com/; Lead Free: LeadFree; Packaging: TapeandReel; Min Operating Temperature: -35degC; Mechanical Life: 20000Cycles; Mount: SurfaceMount; REACH SVHC: Unknown; Package Quantity: 1800; Package Reference: FSMSMTR; RoHSCompliant: true; Max Operating Temperature: 85degC; Orientation: Straight; ELV: Compliant; Datasheet URL: http://www.te.com/commerce/DocumentDelivery/DDEController?Action=showdoc&DocId=Customer+Drawing%7F1437566-3%7FC2%7Fpdf%7FEnglish%7FENG_CD_1437566-3_C2_1437566_3_1_c.dwg.pdf%7F1437566-4; Package Description: 2-Pin Surface Mount Device, Body 6 x 3.5 mm, Pitch 9.19 mm; Current Rating: 50mA; Contact Plating: Silver; Termination: GullWing; Datasheet Version: Rev. C2, 08/2014; Contact Material: Brass; Mounting Technology: SurfaceMount
T1 T2 = CMP-02550-000285-1: MOSFET N/P-CH 20V SC89-6; Polarity: N-CHANNEL; Number of Elements: 2; Rds On Max: 700mR; Max Power Dissipation: 250mW; Drain to Source Resistance: 800mR; Gate to Source Voltage (Vgs): 6V; FET Type: N and P-Channel; Continuous Drain Current (ID): 370mA; Lead Free: Lead Free; Radiation Hardening: No; Drain to Source Breakdown Voltage: 20V; Package Quantity: 3000; Mount: Surface Mount; Height: 0.6mm; Drain-source On Resistance-Max: 700mR; RoHS Compliant: Yes; Max Operating Temperature: 150°C; Series: TrenchFET®; Packaging: Tape and Reel; Min Operating Temperature: -55°C; Number of Pins: 6; On-State Resistance: 700mR; Width: 1.2mm; Weight: 0.001129oz; Length: 1.7mm; Power Dissipation: 250mW; Drain to Source Voltage (Vdss): 20V; Number of Channels: 2; Case/Package: SOT-563
Teensy_1 = CMP-003-000000-1: RT1062 Teensy 4.1 series ARMÂ® CortexÂ®-M7 MPU Embedded Evaluation Board; MF: SparkFun Electronics; MP: DEV-16771; Package: None; Component Type: Standard; Pin Count: 65; Purchase-URL: https://pricing.snapeda.com/search/part/DEV-16771/?ref=eda; SnapEDA_Link: https://www.snapeda.com/parts/DEV-16771/SparkFun+Electronics/view-part/?ref=snap; Availability: In Stock; Source: DEV-16771.SchLib; Design Item ID: DEV-16771; Check_prices: https://www.snapeda.com/parts/DEV-16771/SparkFun+Electronics/view-part/?ref=eda; Value: *; Price: None
Type_c1 = CMP-196119-000001-2: CONN RCPT USB2.0 TYPE C 24POS RA; Gender: Receptacle; Number of Positions: 16; USB Standard: USB 2.0; Orientation: Right Angle; Contact Plating: Gold; Contact Material: Copper Alloy
U1 = CMP-04917-000136-1: IC REG LIN POS ADJ 500MA TO252-3; Min Output Voltage: 1.25V; Dropout Voltage: 2V; Polarity: Positive; Reference Voltage: 1.3V; Max Input Voltage: 40V; Min Input Voltage: 4.2V; Power Supply Rejection Ratio (PSRR): 80dB; Number of Outputs: 1; Max Output Voltage: 37V; Output Type: Adjustable; Quiescent Current: 3.5mA; Radiation Hardening: No; Number of Pins: 3; Package Quantity: 2500; RoHS Compliant: Yes; Height: 2.39mm; Contact Plating: Tin; Min Operating Temperature: -40°C; Packaging: Tape and Reel; Case/Package: TO-252-3; Weight: 0.011598oz; Length: 6.7mm; Max Output Current: 500mA; Number of Regulators: 1; Max Operating Temperature: 125°C; Width: 6.22mm; REACH SVHC: No SVHC; Output Voltage: 37V; Lead Free: Lead Free; Output Current: 500mA; Min Current Limit: 500mA; Mount: Surface Mount
u_1 = CMP-2000-06822-2: IC BUF NON-INVERT 5.5V SC70-6; Propagation Delay: 12.6ns; Max Power Dissipation: 180mW; High Level Output Current: 32mA; Number of Outputs: 2; Number of Bits per Element: 1; Polarity: Non-Inverting; Max Supply Current: 24mA; Turn-On Delay Time: 11.5ns; Logic Function: Buffer; Min Supply Voltage: 1.65V; Quiescent Current: 1uA; REACH SVHC: No SVHC; Lead Free: Lead Free; Packaging: Tape and Reel; Low Level Output Current: 32mA; Number of Channels: 2; Number of Output Lines: 2; Number of Bits: 2; Min Operating Temperature: -40°C; Radiation Hardening: No; Number of Elements: 2; Number of Pins: 6; Number of Inputs: 2; Max Supply Voltage: 5.5V; Package Quantity: 1; Termination: SMD/SMT; Number of Input Lines: 2; Number of Circuits: 2; Weight: 0.028g; Max Operating Temperature: 85°C; Case/Package: SC; Length: 2mm; Width: 1.25mm; Mount: Surface Mount; Height: 1mm
X1 = CMP-003-00019-2: Ceramic SMD Crystal, 24 MHz, +/- 20 ppm, 18 pF, -20 to 70 degC, 4-Pin SMD, RoHS, Tape and Reel; Manufacturer: Abracon; Load Capacitance: 18pF; Frequency Tolerance: 20ppm; ESR: 50; Resistance: 50Ohm; Frequency: 24MHz; Package Quantity: 1000; Packaging: TapeandReel; RoHS Compliant: True; Package Description: 4-Pin Surface Mount Device, Body 5 x 3.2 mm; Mounting Technology: SM; Pins: 4; Datasheet URL: http://www.abracon.com/Resonators/abm3b.pdf; Tolerance: 20ppm; Manufacturer URL: http://www.abracon.com/; Max Operating Temperature: 70°C; Datasheet Version: Aug-15; Min Operating Temperature: -20°C; Package Reference: ABM3B; Case/Package: CSMD
Y1 = CMP-06057-000013-1: CERAMIC RES 20.0000MHZ 15PF SMD; Self Resonant Frequency: 20MHz; Frequency Stability: 0.3%; Tolerance: 0.5%; Impedance: 40R; Height: 0.039inch; Package Quantity: 3000; Capacitance: 15pF; Mount: Surface Mount; Length: 0.126inch; Load Capacitance: 15pF; Resistor Type: Ceramic; Width: 0.051inch; Termination: SMD/SMT; Frequency Tolerance: 0.5%; Case/Package: SMD/SMT; Contact Plating: Gold; Lead Free: Lead Free; Number of Pins: 3; Packaging: Tape and Reel; Min Operating Temperature: -20°C; REACH SVHC: No SVHC; Max Operating Temperature: 80°C; Frequency: 20MHz